# Altium schematic sheet Pressure sensor - SCP1000-D01.SchDoc
size A4; Organization: Altium Limited; Address1: 3 Minna Close; Address2: Belrose; Address3: NSW 2085; Address4: Australia
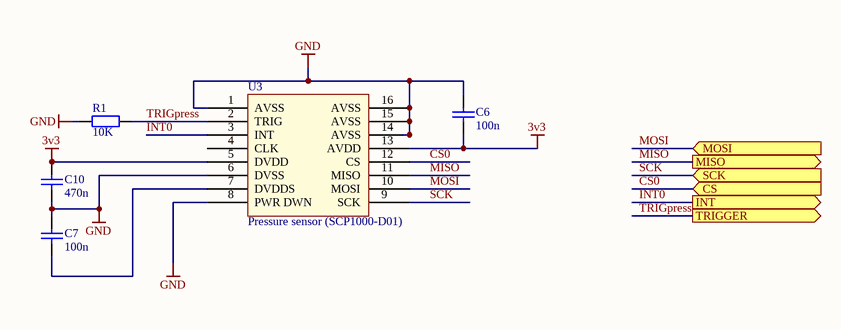
[diagram p0: Pressure sensor - SCP1000-D01.SchDoc]

## Parts
C6  100n  [C0805]
C7  100n  [C0805]
C10  470n  [C0805]
R1  value 10K  [R0805]  (hidden comment: RESISTOR)
U3  Pressure sensor (SCP1000-D01)  [SCP1000-D01]

## Ports
CS (in), INT (out), MISO (out), MOSI (in), SCK (in), TRIGGER (out)

## Nets
3v3: C6.1 C10.2 U3.5(DVDD) U3.13(AVDD)
GND: C6.2 C7.2 C10.1 R1.1 U3.1(AVSS) U3.6(DVSS) U3.8(PWR_DWN) U3.14(AVSS) U3.15(AVSS) U3.16(AVSS)
CS0: U3.12(CS) ; port CS
INT0: U3.3(INT) ; port INT
MISO: U3.11(MISO) ; port MISO
MOSI: U3.10(MOSI) ; port MOSI
SCK: U3.9(SCK) ; port SCK
TRIGpress: R1.2 U3.2(TRIG) ; port TRIGGER
NetC7_1: C7.1 U3.7(DVDDS)

Not connected (* = marked no-connect by the designer): U3 4(CLK)

## Notes on the sheet
- Title
- Size:
- Date:
- A4
- Name:
- Time:
- Ing. W. Pietersz
- Revision:
- Sheet
- of
- WillyPietersz@gmail.com
- Contact:
- info@unique-system.nl
- Unique System Elektronics
- Biesboschhaven noord 1-b
- 4251 NL Werkendam
- Netherlands
- www.unique-system.nl
- File:

## Library data of the parts
C6 C7 = 100n: Tolerance: 0.1; LatestRevision Note: Initial Release; Part Number: 100n; Value: 100n; Package: 0805; Component Type: Standard; LatestRevision Date: 31-7-2010; Author: Willy Pietersz; Supplier 2: Farnell; Supplier Part Number 2: 1759266; ComponentLink1Description: Manufacturer; ComponentLink2Description: Datasheet
C10 = 470n: Tolerance: 0.1; LatestRevision Note: Initial Release; Part Number: 470n; Value: 470n; Package: 0805; Component Type: Standard; LatestRevision Date: 31-7-2010; Author: Willy Pietersz; ComponentLink1Description: Manufacturer; ComponentLink2Description: Datasheet
R1 = 10K: Manufacturer 1: Panasonic; Manufacturer 1 Part No: ERJT06J103V; Power: 0.25W; Tolerance: 0.05; LatestRevision Note: Initial Release; Published: 8-Jun-2000; LatestRevisionDate: 17-Jul-2002; LatestRevisionNote: Re-released for DXP Platform.; PackageReference: AXIAL-0.4; Publisher: Altium Limited; Part Number: 10K; Type: Film; Package: 0805; Component Type: Standard; LatestRevision Date: 30-7-2010; Author: Willy Pietersz; ROHS: Y; Supplier 2: Farnell; Supplier Part Number 2: 1618242; ComponentLink1Description: Manufacturer; ComponentLink2Description: Datasheet
U3 = SCP1000-D01: Part Number: SCP1000-D01; Component Type: Sensor; Supplier 1: Sparkfun; Supplier Part Number 1: SCP1000-D01; ComponentLink1Description: Datasheet; ComponentLink1URL: http://www.sparkfun.com/datasheets/Components/SCP1000-D01.pdf